# EAGLE design DIP8051-50x100-realaddr-partsmt (EAGLE 7.6.0)
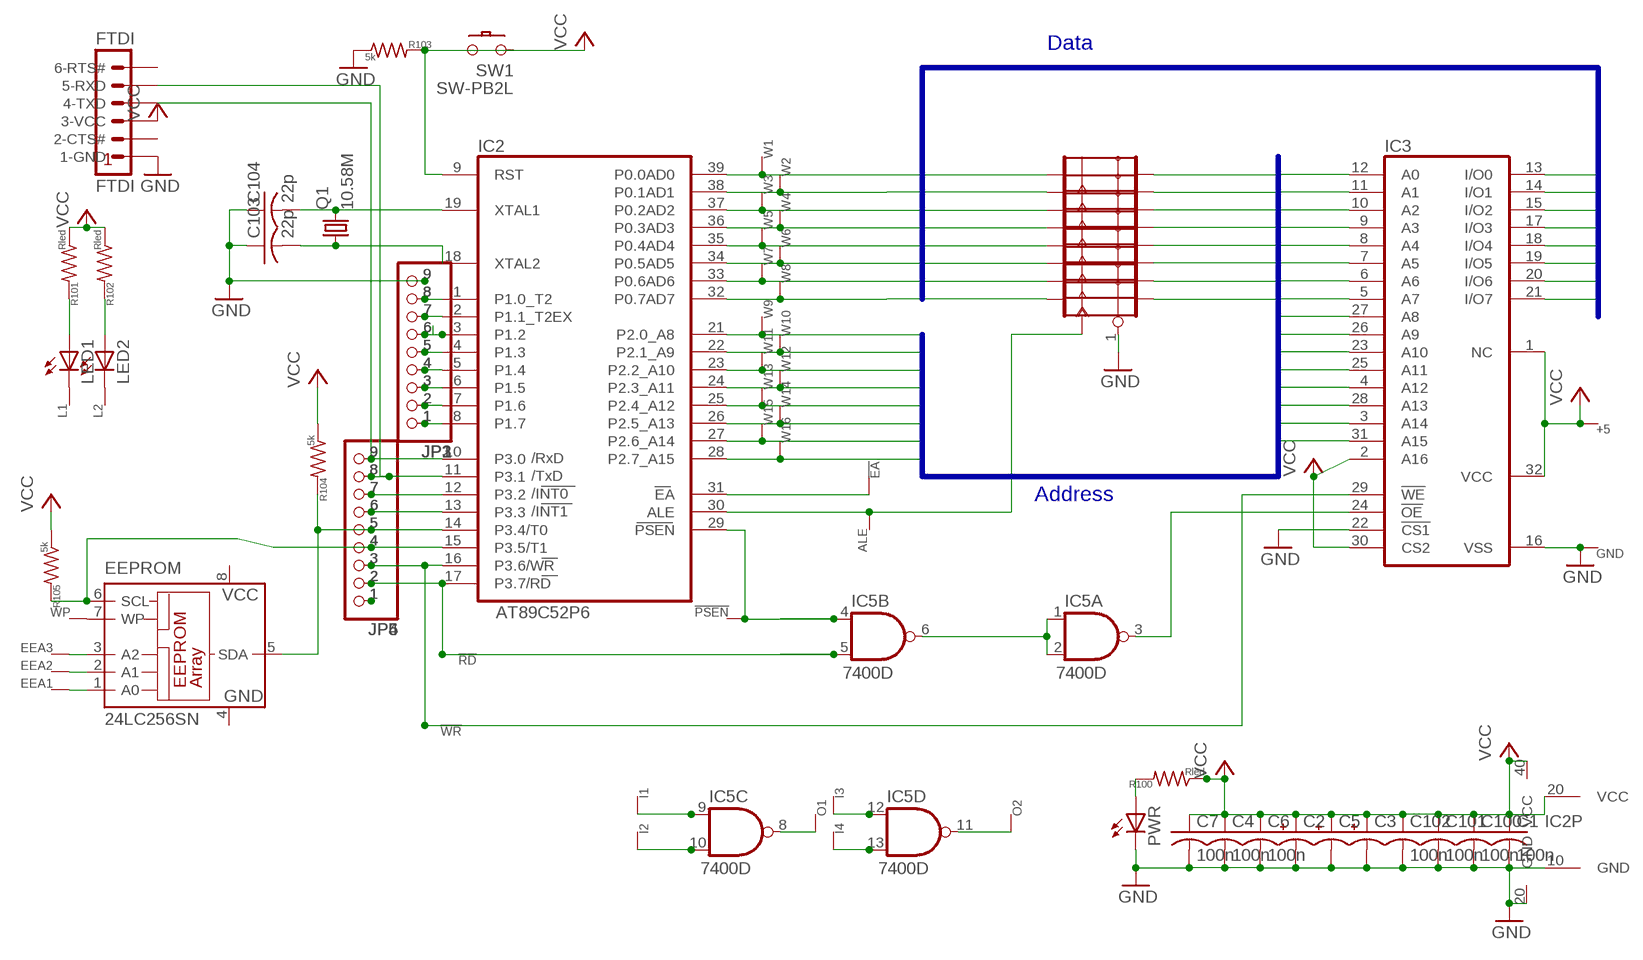
[diagram p0: schematic, sheet 1]

## Parts
!EA  WIRE-R10  [VIA10]
!PSEN  WIRE-R10  [VIA10]
!RD  WIRE-R10  [VIA10]
!WR  WIRE-R10  [VIA10]
+5  WIRE-R12  [VIA12]
ALE  WIRE-R10  [VIA10]
C1  100n  C-US-5MM  [C050-024X044]
C2  CPOL-US-C  [SMC_C]
C3  CPOL-USE2.5-7  [E2,5-7]
C4  100n  C-USC0805  [C0805]
C5  CPOL-US-C  [SMC_C]
C6  100n  C-US-5MM  [C050-024X044]
C7  100n  C-USC0805  [C0805]
C100  100n  C-USC0805  [C0805]
C101  100n  C-USC0805  [C0805]
C102  100n  C-USC0805  [C0805]
C103  22p  C-USC0805  [C0805]
C104  22p  C-USC0805  [C0805]
EEA1  WIRE-R6  [VIA6]
EEA2  WIRE-R6  [VIA6]
EEA3  WIRE-R6  [VIA6]
EEPROM  24LC256SN  [SO-08]
FTDI  FTDI  FTDI-TTL232R  [MA06-1]
GND  WIRE-R12  [VIA12]
I1  WIRE-VIA8  [VIA8]
I2  WIRE-VIA8  [VIA8]
I3  WIRE-VIA8  [VIA8]
I4  WIRE-VIA8  [VIA8]
IC1  74573D  [SO20W]
IC2  AT89C52P6  [DIL40]
IC3  MEM128K-PS  [DIL32]
IC5  7400D  [SO14]
JP1  PINHD-1X9  [1X09]
JP2  PINHD-1X9  [1X09]
JP3  PINHD-1X9  [1X09]
JP4  PINHD-1X9  [1X09]
JP5  PINHD-1X9  [1X09]
JP6  PINHD-1X9  [1X09]
L1  WIRE-VIA8  [VIA8]
L2  WIRE-VIA8  [VIA8]
LED1  LED3MM  [LED3MM]
LED2  LED3MM  [LED3MM]
O1  WIRE-VIA8  [VIA8]
O2  WIRE-VIA8  [VIA8]
PWR  LED3MM  [LED3MM]
Q1  10.58M  CRYSTALHC49S  [HC49/S]
R100  Rled  R-US_R0805  [R0805]
R101  Rled  R-US_R0805  [R0805]
R102  Rled  R-US_R0805  [R0805]
R103  5k  R-US_R0805  [R0805]
R104  5k  R-US_R0805  [R0805]
R105  5k  R-US_R0805  [R0805]
SW1  SW-PB2L  [SW-PB]
W1  WIRE-R10  [VIA10]
W2  WIRE-R10  [VIA10]
W3  WIRE-R10  [VIA10]
W4  WIRE-R10  [VIA10]
W5  WIRE-R10  [VIA10]
W6  WIRE-R10  [VIA10]
W7  WIRE-R10  [VIA10]
W8  WIRE-R10  [VIA10]
W9  WIRE-R10  [VIA10]
W10  WIRE-R10  [VIA10]
W11  WIRE-R10  [VIA10]
W12  WIRE-R10  [VIA10]
W13  WIRE-R10  [VIA10]
W14  WIRE-R10  [VIA10]
W15  WIRE-R10  [VIA10]
W16  WIRE-R10  [VIA10]
WP  WIRE-VIA8  [VIA8]

## Nets
!EA: !EA.P$1 IC2.31(EA)
!OE: IC3.24(!OE) IC5.3(A:O)
!RD: !RD.P$1 IC2.17(P3.7/RD) IC5.5(B:I1) JP4.2 JP5.2 JP6.2
!WR: !WR.P$1 IC2.16(P3.6/WR) IC3.29(!WE) JP4.3 JP5.3 JP6.3
A0: IC1.19(Q) IC3.12(A0)
A1: IC1.18(Q) IC3.11(A1)
A2: IC1.17(Q) IC3.10(A2)
A3: IC1.16(Q) IC3.9(A3)
A4: IC1.15(Q) IC3.8(A4)
A5: IC1.14(Q) IC3.7(A5)
A6: IC1.13(Q) IC3.6(A6)
A7: IC1.12(Q) IC3.5(A7)
A8: IC2.21(P2.0_A8) IC3.27(A8) W9.P$1
A9: IC2.22(P2.1_A9) IC3.26(A9) W10.P$1
A10: IC2.23(P2.2_A10) IC3.23(A10) W11.P$1
A11: IC2.24(P2.3_A11) IC3.25(A11) W12.P$1
A12: IC2.25(P2.4_A12) IC3.4(A12) W13.P$1
A13: IC2.26(P2.5_A13) IC3.28(A13) W14.P$1
A14: IC2.27(P2.6_A14) IC3.3(A14) W15.P$1
A15: IC2.28(P2.7_A15) IC3.31(A15) W16.P$1
ALE: ALE.P$1 IC1.11(CLK) IC2.30(ALE)
D0: IC1.2(D) IC2.39(P0.0AD0) IC3.13(I/O0) W1.P$1
D1: IC1.3(D) IC2.38(P0.1AD1) IC3.14(I/O1) W2.P$1
D2: IC1.4(D) IC2.37(P0.2AD2) IC3.15(I/O2) W3.P$1
D3: IC1.5(D) IC2.36(P0.3AD3) IC3.17(I/O3) W4.P$1
D4: IC1.6(D) IC2.35(P0.4AD4) IC3.18(I/O4) W5.P$1
D5: IC1.7(D) IC2.34(P0.5AD5) IC3.19(I/O5) W6.P$1
D6: IC1.8(D) IC2.33(P0.6AD6) IC3.20(I/O6) W7.P$1
D7: IC1.9(D) IC2.32(P0.7AD7) IC3.21(I/O7) W8.P$1
GND [power]: C1.2 C2.- C3.- C4.2 C5.- C6.2 C7.2 C100.2 C101.2 C102.2 C103.1 C104.1 FTDI.1(1-GND) GND.P$1 IC1.1(OE) IC1.10(GND) IC2.20(GND) IC3.16(VSS) IC3.22(!CS1) JP1.9 JP2.9 JP3.9 PWR.K(C) R103.1
N$1: IC2.8(P1.7) JP1.1 JP2.1 JP3.1
N$3: EEA3.P$1 EEPROM.3(A2)
N$5: LED1.A R101.2
N$6: PWR.A R100.2
N$7: LED2.A R102.2
N$8: EEA2.P$1 EEPROM.2(A1)
N$9: EEA1.P$1 EEPROM.1(A0)
N$10: IC5.1(A:I0) IC5.2(A:I1) IC5.6(B:O)
N$11: IC2.7(P1.6) JP1.2 JP2.2 JP3.2
N$12: EEPROM.7(WP) WP.P$1
N$13: IC2.6(P1.5) JP1.3 JP2.3 JP3.3
N$14: IC2.5(P1.4) JP1.4 JP2.4 JP3.4
N$15: IC2.4(P1.3) JP1.5 JP2.5 JP3.5
N$16: IC2.2(P1.1_T2EX) JP1.7 JP2.7 JP3.7
N$17: C103.2 IC2.18(XTAL2) Q1.1
N$18: C104.2 IC2.19(XTAL1) Q1.2
N$19: IC2.1(P1.0_T2) JP1.8 JP2.8 JP3.8
N$20: IC2.12(P3.2) JP4.7 JP5.7 JP6.7
N$21: IC2.13(P3.3) JP4.6 JP5.6 JP6.6
N$22: !PSEN.P$1 IC2.29(PSEN) IC5.4(B:I0)
N$23: I3.P$1 IC5.12(D:I0)
N$24: I4.P$1 IC5.13(D:I1)
N$25: IC5.11(D:O) O2.P$1
N$26: IC2.3(P1.2) JP1.6 JP2.6 JP3.6
N$27: I1.P$1 IC5.9(C:I0)
N$28: I2.P$1 IC5.10(C:I1)
N$29: IC5.8(C:O) O1.P$1
N$31: JP4.1 JP5.1 JP6.1
N$33: L1.P$1 LED1.K(C)
N$35: L2.P$1 LED2.K(C)
N$36: IC2.9(RST) R103.2 SW1.2
RXD: FTDI.4(4-TXD) IC2.10(P3.0) JP4.9 JP5.9 JP6.9
T0: EEPROM.5(SDA) IC2.14(P3.4/T0) JP4.5 JP5.5 JP6.5 R104.2
T1: EEPROM.6(SCL) IC2.15(P3.5/T1) JP4.4 JP5.4 JP6.4 R105.2
TXD: FTDI.5(5-RXD) IC2.11(P3.1) JP4.8 JP5.8 JP6.8
VCC [power]: +5.P$1 C1.1 C2.+ C3.+ C4.1 C5.+ C6.1 C7.1 C100.1 C101.1 C102.1 FTDI.3(3-VCC) IC1.20(VCC) IC2.40(VCC) IC3.1(NC) IC3.2(A16) IC3.30(CS2) IC3.32(VCC) R100.1 R101.1 R102.1 R104.1 R105.1 SW1.4
Unconnected: FTDI.2(2-CTS#) FTDI.6(6-RTS#)

## Buses
D[0..7]
A[0..15]

## Notes on the sheet
- Data
- Address

## Power pins joined to a net without a drawn wire
GND: EEPROM.4(GND) IC5.7(P:GND) SW1.5(GND)
VCC: EEPROM.8(VCC) IC5.14(P:VCC)

## Library data of the parts
!EA !PSEN !RD !WR +5 ALE EEA1-EEA3 GND I1-I4 L1 L2 O1 O2 W1-W16 WP = mylib4:WIRE: Pad for a wire offboard
C1 C4 C6 C7 C100-C104 = my-rcl:C-US: CAPACITOR, American symbol
C2 C3 C5 = my-rcl:CPOL-US: POLARIZED CAPACITOR, American symbol
EEPROM = microchip-6:24*: Serial EEPROM I2C
FTDI = mylib4:FTDI-TTL232R: FTDI USB to serial (TTL level) cable
IC1 = mylib4:74*573: 74x573 and similar octal latches, with gate-swappable latches
IC2 = atmel:AT89C*52: MICROCONTROLLER 8 Kbytes FLASH; 2K Bytes EEPROM Compatible with MCS-51 Products at89s8252.pdf; OC_FARNELL: unknown; OC_NEWARK: unknown
IC3 = mylib4:MEM128K-PS: MEMORY; OC_FARNELL: unknown; OC_NEWARK: unknown
IC5 = mylib4:74*00: Quad 2-input NAND gate
JP1-JP6 = pinhead:PINHD-1X9: PIN HEADER
LED1 LED2 PWR = my-led:LED: LED OSRAM: - CHIPLED LG R971, LG N971, LY N971, LG Q971, LY Q971, LO R971, LY R971 LH N974, LH R974 LS Q976, LO Q976, LY Q976 LO Q996 - Hyper CHIPLED LW Q18S LB Q993, LB Q99A, LB R99A - SideLED LS A670, LO A670, LY A670, LG A670, LP A670 LB A673, LV A673, LT A673, LW A673 LH A674 LY A675 LS A676, LA A676, LO A676, LY A676, LW A676 LS A679, LY A679, LG A679 - Hyper Micro SIDELED® LS Y876, LA Y876, LO Y876, LY Y876 LT Y87S - SmartLED LW L88C, LW L88S LB L89C, LB L89S, LG L890 LS L89K, LO L89K, LY L89K LS L896, LA L896, LO L896, LY L896 - TOPLED LS T670, LO T670, LY T670, LG T670, LP T670 LSG T670, LSP T670, LSY T670, LOP T670, LYG T670 LG T671, LOG T671, LSG T671 LB T673, LV T673, LT T673, LW T673 LH T674 LS T676, LA T676, LO T676, LY T676, LB T676, LH T676, LSB T676, LW T676 LB T67C, LV T67C, LT T67C, LS T67K, LO T67K, LY T67K, LW E67C LS E67B, LA E67B, LO E67B, LY E67B, LB E67C, LV E67C, LT E67C LW T67C LS T679, LY T679, LG T679 LS T770, LO T770, LY T770, LG T770, LP T770 LB T773, LV T773, LT T773, LW T773 LH T774 LS E675, LA E675, LY E675, LS T675 LS T776, LA T776, LO T776, LY T776, LB T776 LHGB T686 LT T68C, LB T68C - Hyper Mini TOPLED® LB M676 - Mini TOPLED Santana® LG M470 LS M47K, LO M47K, LY M47K Source: http://www.osram.convergy.de/
Q1 = mylib4:CRYSTAL: CRYSTAL
R100-R105 = my-rcl:R-US_: RESISTOR, American symbol
SW1 = mylib4:SW-PB2; PARTNO: test2

## Net classes
0 default: width 0.3 mm, drill 0.4 mm, clearance 0.3 mm
1 power: width 0.5 mm, drill 0.6 mm, clearance 0.4 mm

## Board
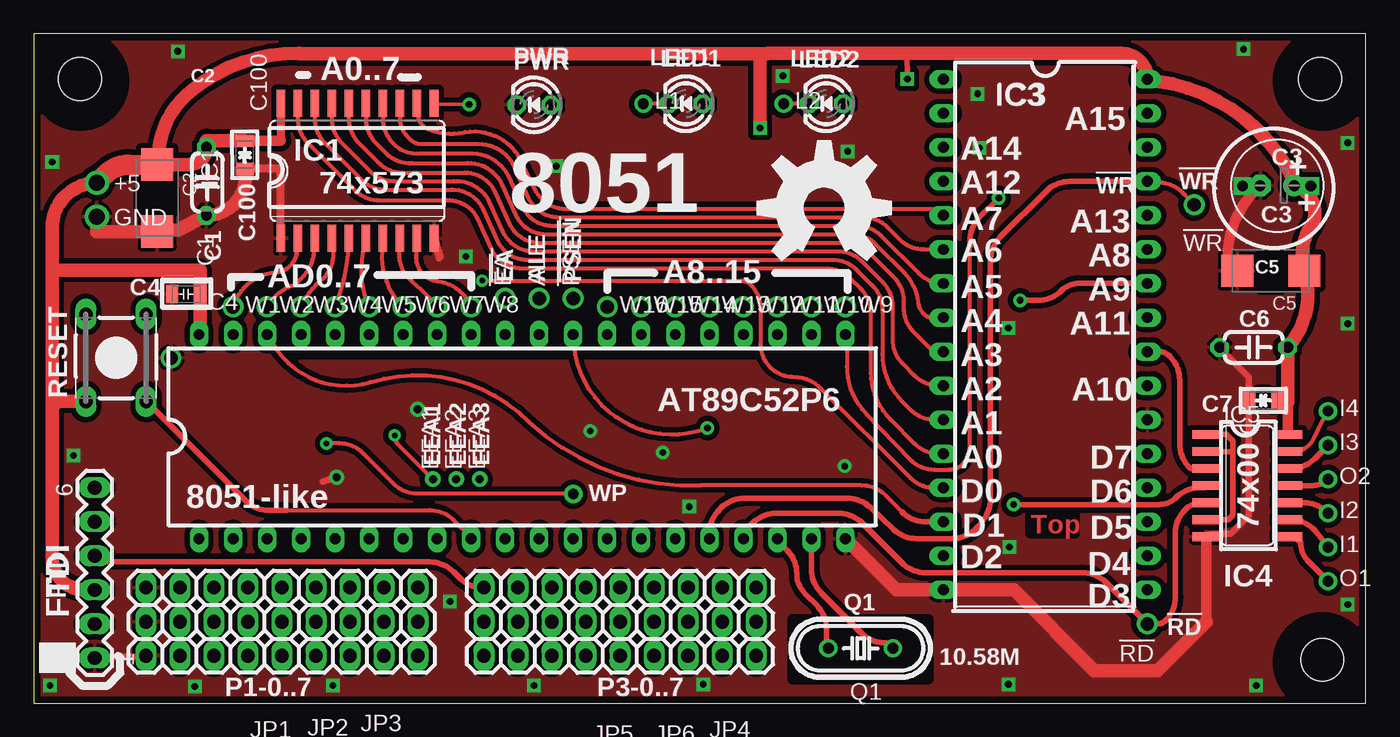
[diagram p1: board, top side]
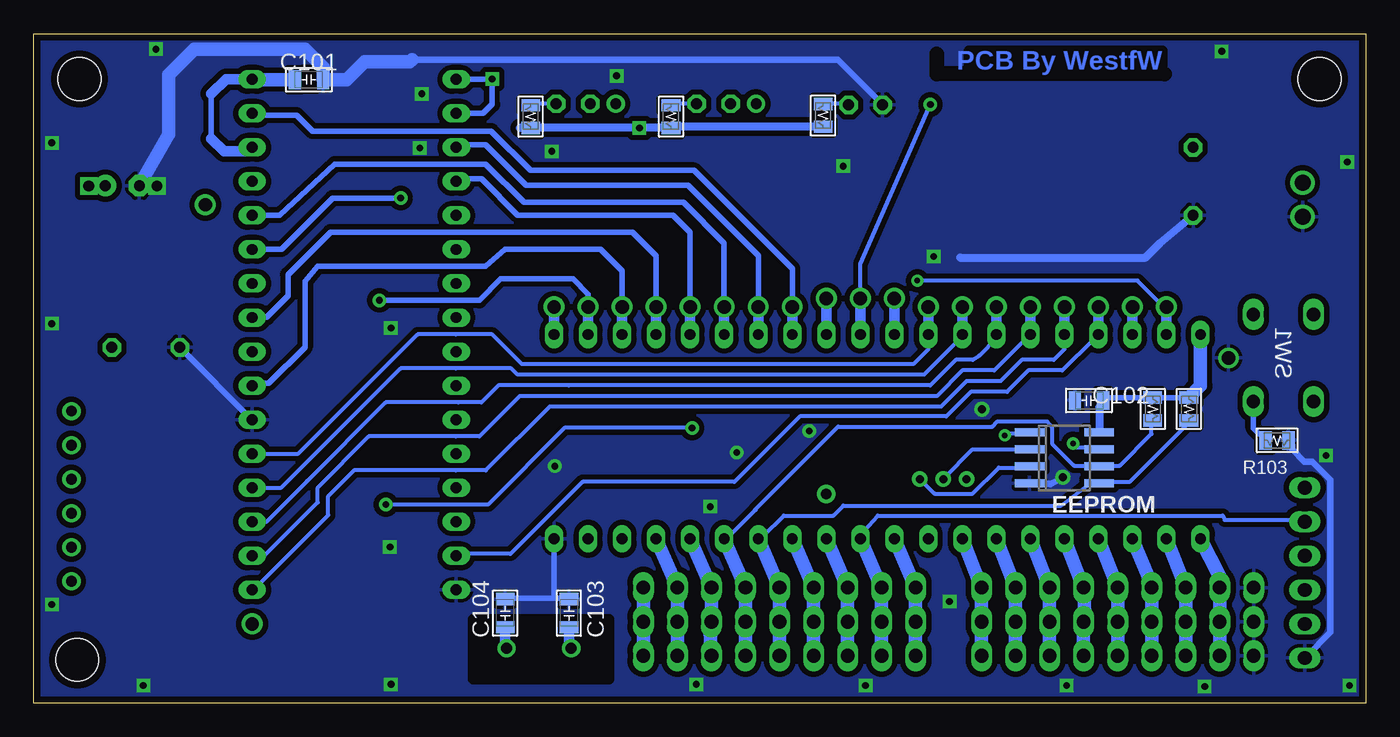
[diagram p2: board, bottom side, seen from below]

Size 99.48 x 49.97 mm. Coordinates in mm from the lower left corner, seen from the top.
Outline: 0,0 99.48,0 99.48,49.97 0,49.97 0,0
Copper layers (1*16): Top 0.035mm / dielectric 1.5mm / Bottom 0.035mm
Design rules "default *": minimum track width 7mil, minimum drill 0.3mm, track to track 8mil, track to pad 8mil, pad to pad 8mil, via to via 8mil, smd to smd 8mil, copper to edge 20mil, drill to drill 8mil, minimum pad ring 11mil, minimum via ring 10mil, stop-mask expansion 4mil, vias tented up to drill 0.65mm, thermal gap 10mil
Holes 3.2 mm at 3.46,46.58 96.04,46.58 96.2,3.22
tRestrict: area 7.9,36.7 to 10.6,38.3; area 91.6,30.8 to 93.2,33.5; area 11.1,29.9 to 11.9,31.3; area 91.4,21.9 to 92.2,23.4; area 15.1,40.4 to 16.2,41.2; area 56.7,1.8 to 66.8,6.2; area 93.2,43.4 to 99.2,49.4; area 93.2,0.1 to 99.2,6.1; area 0.5,43.4 to 6.5,49.4; 2 lines
bRestrict: area 13.5,50.8 to 14.9,51.7; area 78.4,45.8 to 79.3,47.3; area 56.5,1.8 to 66.7,6.2; 2 lines

### Footprints (pad centres in the part's own frame; a part is rotated, then mirrored left to right if it is on the bottom)
VIA10 = drill 1: P$1 0,0
VIA12 = drill 1.2: P$1 0,0
C050-024X044 = drill 0.813 octagon: 1 -2.54,0; 2 2.54,0
SMC_C = smd 2.4 x 2.4: + -2.5,0; - 2.5,0
E2,5-7 = drill 0.813 pad 1.6: + -1.27,0 | drill 0.813 pad 1.6 octagon: - 1.27,0
C0805 = smd 0.914 x 1.397: 1 -1.053,0; 2 1.053,0
VIA6 = drill 0.6: P$1 0,0
SO-08 = smd 0.6 x 2.2: 1 -1.905,-2.6; 2 -0.635,-2.6; 3 0.635,-2.6; 4 1.905,-2.6; 5 1.905,2.6; 6 0.635,2.6; 7 -0.635,2.6; 8 -1.905,2.6
MA06-1 = drill 1.016 long: 1 -6.35,0; 2 -3.81,0; 3 -1.27,0; 4 1.27,0; 5 3.81,0; 6 6.35,0
VIA8 = drill 0.8: P$1 0,0
SO20W = smd 0.66 x 2.032: 1 -5.08,-5.029; 2 -3.81,-5.029; 3 -2.54,-5.029; 4 -1.27,-5.029; 5 0,-5.029; 6 1.27,-5.029; 7 2.54,-5.029; 8 3.81,-5.029; 9 5.08,-5.029; 10 6.35,-5.029; 11 6.35,5.029; 12 5.08,5.029; 13 3.81,5.029; 14 2.54,5.029; 15 1.27,5.029; 16 0,5.029; 17 -1.27,5.029; 18 -2.54,5.029; 19 -3.81,5.029; 20 -5.08,5.029
DIL40 = drill 0.813 long: 1 -24.13,-7.62; 2 -21.59,-7.62; 3 -19.05,-7.62; 4 -16.51,-7.62; 5 -13.97,-7.62; 6 -11.43,-7.62; 7 -8.89,-7.62; 8 -6.35,-7.62; 9 -3.81,-7.62; 10 -1.27,-7.62; 11 1.27,-7.62; 12 3.81,-7.62; 13 6.35,-7.62; 14 8.89,-7.62; 15 11.43,-7.62; 16 13.97,-7.62; 17 16.51,-7.62; 18 19.05,-7.62; 19 21.59,-7.62; 20 24.13,-7.62; 21 24.13,7.62; 22 21.59,7.62; 23 19.05,7.62; 24 16.51,7.62; 25 13.97,7.62; 26 11.43,7.62; 27 8.89,7.62; 28 6.35,7.62; 29 3.81,7.62; 30 1.27,7.62; 31 -1.27,7.62; 32 -3.81,7.62; 33 -6.35,7.62; 34 -8.89,7.62; 35 -11.43,7.62; 36 -13.97,7.62; 37 -16.51,7.62; 38 -19.05,7.62; 39 -21.59,7.62; 40 -24.13,7.62
DIL32 = drill 0.813 long: 1 -19.05,-7.62; 2 -16.51,-7.62; 3 -13.97,-7.62; 4 -11.43,-7.62; 5 -8.89,-7.62; 6 -6.35,-7.62; 7 -3.81,-7.62; 8 -1.27,-7.62; 9 1.27,-7.62; 10 3.81,-7.62; 11 6.35,-7.62; 12 8.89,-7.62; 13 11.43,-7.62; 14 13.97,-7.62; 15 16.51,-7.62; 16 19.05,-7.62; 17 19.05,7.62; 18 16.51,7.62; 19 13.97,7.62; 20 11.43,7.62; 21 8.89,7.62; 22 6.35,7.62; 23 3.81,7.62; 24 1.27,7.62; 25 -1.27,7.62; 26 -3.81,7.62; 27 -6.35,7.62; 28 -8.89,7.62; 29 -11.43,7.62; 30 -13.97,7.62; 31 -16.51,7.62; 32 -19.05,7.62
SO14 = smd 0.66 x 2.032: 1 -3.81,-3.073; 2 -2.54,-3.073; 3 -1.27,-3.073; 4 0,-3.073; 5 1.27,-3.073; 6 2.54,-3.073; 7 3.81,-3.073; 8 3.81,3.073; 9 2.54,3.073; 10 1.27,3.073; 11 0,3.073; 12 -1.27,3.073; 13 -2.54,3.073; 14 -3.81,3.073
1X09 = drill 1.016 long: 1 -10.16,0; 2 -7.62,0; 3 -5.08,0; 4 -2.54,0; 5 0,0; 6 2.54,0; 7 5.08,0; 8 7.62,0; 9 10.16,0
LED3MM = drill 0.813 octagon: A -1.27,0; K 1.27,0
HC49/S = drill 0.813: 1 -2.413,0; 2 2.413,0
R0805 = smd 0.914 x 1.397: 1 -0.85,0; 2 0.85,0
SW-PB = drill 1 long: 1 3.25,-2.25; 2 -3.25,-2.25; 3 3.25,2.25; 4 -3.25,2.25 | drill 1: 5 0,-4.1

### Placement (x,y rotation side)
!EA  35.21,30.2 90 top
!PSEN  40.29,30.2 90 top
!RD  83.16,5.91 0 top
!WR  86.65,37.19 0 top
+5  4.74,38.82 0 top
ALE  37.75,30.2 90 top
C1  12.91,38.93 270 top
C2  9.24,37.69 270 top
C3  92.84,38.61 180 top
C4  11.4,30.52 180 top
C5  92.36,32.26 180 top
C6  91.09,26.55 180 top
C7  91.81,22.58 180 top
C100  15.77,40.92 270 top
C101  78.92,46.52 0 bottom
C102  20.69,22.58 180 bottom
C103  59.5,6.71 270 bottom
C104  64.26,6.71 270 bottom
EEA1  29.81,16.71 90 top
EEA2  31.56,16.71 90 top
EEA3  33.31,16.71 90 top
EEPROM  22.51,18.3 270 bottom
FTDI  4.57,9.72 90 top
GND  4.74,36.28 0 top
I1  96.65,11.63 0 top
I2  96.65,14.17 0 top
I3  96.65,19.25 0 top
I4  96.65,21.79 0 top
IC1  23.54,39.73 0 top
IC2  36.48,19.88 0 top
IC3  75.53,27.5 270 top
IC5  90.62,16.23 270 top
JP1  18.54,8.61 180 top
JP2  18.54,6.07 180 top
JP3  18.54,3.53 180 top
JP4  43.78,8.61 180 top
JP5  43.78,6.07 180 top
JP6  43.78,3.53 180 top
L1  45.53,44.73 0 top
L2  56.01,44.73 0 top
LED1  48.71,44.73 180 top
LED2  59.18,44.73 180 top
O1  96.65,9.09 0 top
O2  96.65,16.71 0 top
PWR  37.36,44.65 180 top
Q1  61.75,4.09 0 top
R100  40.53,43.85 90 bottom
R101  51.88,43.77 90 bottom
R102  62.36,43.77 90 bottom
R103  6.64,19.6 180 bottom
R104  13.23,21.95 270 bottom
R105  15.92,21.95 270 bottom
SW1  6.16,25.76 90 top
W1  14.89,29.57 0 top
W2  17.43,29.57 0 top
W3  19.97,29.57 0 top
W4  22.51,29.57 0 top
W5  25.05,29.57 0 top
W6  27.59,29.57 0 top
W7  30.13,29.57 0 top
W8  32.67,29.57 0 top
W9  60.61,29.57 0 top
W10  58.07,29.57 0 top
W11  55.53,29.57 0 top
W12  52.99,29.57 0 top
W13  50.45,29.57 0 top
W14  47.91,29.57 0 top
W15  45.37,29.57 0 top
W16  42.83,29.57 0 top
WP  40.29,15.6 0 top

### Tracks (layer width: path | path; a pad name or v marks a point on that pad's centre or on a via)
!EA
  Bottom 0.8: IC2.31 !EA.P$1
!OE
  Top 0.4: IC5.3 86.48,17.5 arc-45 86.3,17.58 arc-45 85.56,19.35 85.56,24.1 arc45 84.83,25.87 arc45 83.92,26.25 83.17,26.25 IC3.24
!RD
  Top 0.4: IC2.17 52.99,12.74 53.71,13.45 arc-45 55.47,14.18 60.07,14.18 arc-45 61.84,13.45 64.82,10.47 arc45 66.59,9.74 78.3,9.74 arc-45 80.06,9 !RD.P$1 83.95,5.91 arc45 84.51,6.14 arc45 85.25,7.91 85.25,12.67 arc-45 85.98,14.44 arc-45 87.28,14.98 IC5.5
  Bottom 1: JP6.2 JP5.2 JP4.2 IC2.17
!WR
  Top 0.3: !WR.P$1 86.52,37.23 85.91,37.96 arc48 84.07,38.85 83.22,38.88 IC3.29
  Top 0.4: IC3.29 77.37,38.93 arc45 75.6,38.2 72.16,34.76 arc45 71.43,33 71.43,15.19 arc-38 70.91,13.67 70.59,13.25 arc-52 68.61,12.28 65.92,12.28 arc-44 64.2,12.96 62.47,14.61 arc44 60.74,15.29 53.09,15.29 arc45 51.32,14.56 51.2,14.44 arc45 50.47,12.67 50.47,12.28 IC2.16
  Bottom 1: JP6.3 49.04,6.56 JP5.3 JP4.3 IC2.16
A0
  Top 0.3: IC1.19 19.73,43.57 arc45 20.47,41.8 23.85,38.42 arc45 25.62,37.53 30.83,37.53 arc-66 33.11,36.22 34.16,33.91 arc66 36.44,32.44 59.2,32.44 arc-45 60.97,31.71 61.77,30.91 arc-45 62.5,29.15 62.5,24.71 arc45 63.96,21.17 65.78,19.36 arc45 67.54,18.63 67.9,18.63 IC3.12
A1
  Top 0.3: IC1.18 21,43.57 arc45 21.74,41.8 24.49,39.05 arc45 26.25,38.32 31.27,38.32 arc-66 33.55,36.85 34.6,34.54 arc66 36.87,33.08 59.68,33.08 arc-45 61.44,32.35 62.64,31.15 arc-45 63.37,29.38 63.37,26.06 arc45 64.84,22.52 65.46,21.9 arc45 67.22,21.17 67.9,21.17 IC3.11
A2
  Top 0.3: IC1.17 22.27,43.57 arc45 23.01,41.8 25.12,39.69 arc45 26.89,38.95 31.39,38.95 arc-66 33.98,37.49 35.03,35.18 arc66 37.31,33.71 60.06,33.71 arc-45 61.84,32.97 63.41,31.39 arc-45 64.13,29.63 64.13,27.13 arc45 64.86,25.36 65.78,24.44 arc45 67.54,23.71 67.9,23.71 IC3.10
A3
  Top 0.3: IC1.16 23.54,43.57 arc45 24.28,41.8 25.76,40.32 arc45 27.52,39.59 32.19,39.59 arc-66 34.46,38.12 35.51,35.82 arc66 37.79,34.35 60.63,34.35 arc-45 62.4,33.62 64.23,31.79 arc-45 64.96,30.02 64.96,29.47 arc45 65.69,27.7 67.14,26.25 67.9,26.25 IC3.9
A4
  Top 0.3: IC1.15 24.81,43.57 arc45 25.55,41.8 26.39,40.96 arc45 28.24,40.3 32.42,40.3 arc-66 34.94,38.76 35.99,36.45 arc66 38.26,34.98 59.52,34.98 61.1,34.98 arc-45 62.87,34.25 64.94,32.18 arc-39 66.03,29.9 arc106 IC3.8
A5
  Top 0.3: 67.89,31.33 IC3.7 67.89,31.33 | 67.89,31.33 67.86,31.33 arc-45 66.09,32.06 63.27,34.89 arc45 61.5,35.62 60,35.62 38.74,35.62 arc-66 36.46,37.09 35.41,39.39 arc66 32.5,41.02 28.8,41.02 arc-45 27.03,41.59 26.82,41.8 arc-45 26.08,43.57 IC1.14
A6
  Top 0.3: 67.86,33.79 IC3.6 67.62,33.87 66.43,33.87 arc-45 64.66,34.61 63.75,35.52 arc45 61.98,36.26 60.31,36.26 39.22,36.26 arc-66 36.94,37.72 35.89,40.03 arc66 33.22,41.73 28.75,41.73 arc-45 27.93,42.28 arc-45 27.36,43.57 IC1.13
A7
  Top 0.3: 67.7,36.18 IC3.5 67.42,36.89 60.95,36.89 39.69,36.89 arc-65 37.41,38.35 36.52,40.19 arc78 32.21,42.61 arc-34 29.43,42.85 arc-53 28.71,43.72 IC1.12
A8  (via drill 0.5)
  Top 0.3: 69.9,34.1 69.9,19.54 arc-45 69.32,17.77 arc-45 68.33,17.43 67.23,17.43 arc-45 65.47,18.16 62.12,21.64 arc-44 60.72,25.11 60.72,27.48 IC2.21
  Top 0.4: 69.9,34.1 69.9,34.48 arc-45 70.63,36.25 v72.07,37.68
  Bottom 0.4: v72.07,37.68 77.15,37.68 80.96,33.87 83.14,33.87 IC3.27
  Bottom 0.8: IC2.21 W9.P$1
A9  (via drill 0.5)
  Top 0.4: v73.65,30.06 75,30.06 arc45 76.77,30.79 arc-45 78.07,31.33 83.14,31.33 IC3.26
  Bottom 0.4: W10.P$1 58.07,30.52 59.2,31.65 64.6,31.65 66.19,30.06 v73.65,30.06
  Bottom 0.8: IC2.22 W10.P$1
A10
  Bottom 0.4: IC2.23 55.53,32.27 57.14,33.87 64.28,33.87 65.71,32.6 78.26,32.6 79.21,31.49 79.21,26.57 81.91,23.87 82.98,23.87 IC3.23
  Bottom 0.8: IC2.23 W11.P$1
A11
  Bottom 0.4: W12.P$1 52.99,33.38 54.76,35.14 77.31,35.14 80.48,31.97 80.48,30.38 82.07,28.79 83.14,28.79 IC3.25
  Bottom 0.8: IC2.24 W12.P$1
A12
  Bottom 0.4: W13.P$1 50.45,35.13 51.74,36.41 63.33,36.41 66.03,39.11 67.73,39.11 IC3.4
  Bottom 0.8: IC2.25 W13.P$1
A13
  Bottom 0.4: W14.P$1 47.91,34.33 50.95,37.37 62.85,37.37 65.71,40.23 76.99,40.23 81.12,36.41 83.13,36.41 IC3.28
  Bottom 0.8: IC2.26 W14.P$1
A14
  Bottom 0.4: W15.P$1 45.37,33.38 50.63,38.64 62.7,38.64 65.71,41.65 67.73,41.65 IC3.3
  Bottom 0.8: IC2.27 W15.P$1
A15
  Bottom 0.4: W16.P$1 42.83,32.43 50.15,39.75 62.38,39.75 65.32,42.69 78.66,42.69 79.85,43.88 83.02,43.88 IC3.31
  Bottom 0.8: W16.P$1 IC2.28
ALE  (via drill 0.5)
  Top 0.3: v32.52,44.67 29.98,44.67 IC1.11
  Bottom 0.3: ALE.P$1 37.75,32.77 v32.52,44.67
  Bottom 0.8: IC2.30 ALE.P$1
D0  (via drill 0.4)
  Top 0.3: v33.5,31.53 52.81,31.53 arc-45 53.54,31.23 arc-45 54.27,29.46 54.27,26.78 arc45 54.98,25.08 arc45 56.74,24.35 arc-45 58.75,23.51 65.46,16.81 arc45 67.22,16.08 67.77,16.08 IC3.13 | IC1.2 19.66,33.71 arc-81 18.07,32.13 arc69 W1.P$1
  Bottom 0.3: v33.5,31.53 17.07,31.53 15.27,29.73 W1.P$1
  Bottom 0.8: W1.P$1 IC2.39
D1
  Top 0.3: 64.84,14.26 63.59,15.51 arc45 61.82,16.25 49.83,16.25 arc-45 36.97,21.01 arc62 25.14,23.95 arc-75 17.91,26.73 IC2.38 arc27 IC2.38 | IC1.3 20.93,33.71 arc-62 19.03,31.01 arc37 W2.P$1
  Top 0.4: IC3.14 66.6,13.53 arc-45 64.84,14.26
  Bottom 0.8: IC2.38 W2.P$1
D2
  Top 0.3: IC1.4 22.36,33.71 arc-56 21.41,31.49 arc29 W3.P$1
  Bottom 0.3: IC3.15 67.77,11.13 63.87,11.13 58.49,16.51 47.15,16.51 42.26,21.4 31.33,21.4 29.5,23.23 26.81,23.23 25.22,24.82 22.68,24.82 20.37,27.13 19.97,27.48 IC2.37
  Bottom 0.8: W3.P$1 IC2.37
D3
  Top 0.3: IC1.5 23.47,33.71 arc-18 W4.P$1
  Bottom 0.3: IC3.17 83.03,8.45 77.47,14.02 77.47,15.45 75.56,17.36 67.94,17.36 65.71,17.36 60.95,22.12 59.52,22.12 31.73,22.12 29.82,24.03 27.28,24.03 25.7,25.62 23.31,25.62 22.51,26.42 IC2.36
  Bottom 0.8: IC2.36 W4.P$1
D4
  Top 0.3: IC1.6 24.58,33.56 arc36 W5.P$1
  Bottom 0.3: IC3.18 82.24,10.99 78.26,14.98 78.26,16.09 74.45,19.9 67.94,19.9 66.19,19.9 63.17,22.92 59.52,22.92 32.05,22.92 30.14,24.82 27.76,24.82 26.81,25.77 | IC2.35 25.08,27.5 26.81,25.77 | 26.81,25.77
  Bottom 0.8: IC2.35 W5.P$1
D5
  Top 0.3: IC1.7 26.01,33.71 arc50 W6.P$1
  Bottom 0.3: IC2.34 27.59,27.37 27.59,27.21 28.87,25.93 29.35,25.62 30.62,25.62 32.52,23.71 59.52,23.71 64.76,23.71 66.03,22.44 67.78,22.44 | 67.78,22.44 73.18,22.44 79.05,16.56 82.08,13.53 IC3.19 | 67.78,22.44
  Bottom 0.8: IC2.34 W6.P$1
D6
  Top 0.3: IC1.8 27.28,33.71 arc55 28.24,31.49 arc-12 W7.P$1
  Bottom 0.3: IC2.33 30.13,27.37 | IC3.20 80.97,16.07 72.07,24.98 67.94,24.98 63.81,24.98 63.33,24.5 59.52,24.5 33,24.5 30.13,27.37 | 30.13,27.37
  Bottom 0.8: IC2.33 W7.P$1
D7
  Top 0.3: IC1.9 28.55,33.4 arc86 30.14,31.49 arc-60 W8.P$1
  Bottom 0.3: IC2.32 32.67,26.42 33.8,25.3 59.52,25.3 63.01,25.3 65.24,27.52 67.94,27.52 70.8,27.52 79.7,18.61 IC3.21
  Bottom 0.8: IC2.32 W8.P$1
GND  (via drill 0.5, 0.6, 0.8)
  Top 0.5: C6.2 88.62,26.43 90.72,24.33 90.72,22.68 C7.2 90.72,22.38 90.72,13.98 89.37,12.63 87.87,12.63 IC5.7 | 35.97,44.73 PWR.K | FTDI.1 4.62,3.48 8.37,3.48 JP3.9 | JP3.9 8.37,3.63 JP3.9 | JP3.9 8.37,3.78 8.37,6.03 JP2.9 8.37,6.33 8.37,8.58 JP1.9 | 10.32,25.83 SW1.5 10.47,25.68 | 21.57,16.53 v22.63,16.84
  Top 0.6: IC1.10 30.3,33.24 | IC1.1 18.46,39.86 C100.2
  Top 0.8: IC5.7 87.54,6.08 | C5.- 89.12,32.26 89.12,33.12 arc-48 C3.-
  Top 1: GND.P$1 4.74,35.19 C2.- 9.71,35.28 10.77,35.28 | 10.77,35.28 C1.2 arc101 C100.2 | 9.55,35.28 10.77,35.28 | 87.54,6.08 83.89,2.43 79.21,2.43 73.19,8.45 IC3.16 64.42,8.45 IC2.20
  Bottom 0.4: 60.61,7.83 64.28,7.83 60.61,7.83 | 60.61,7.83 59.57,7.83 C103.1 | 60.61,7.83 IC2.20
  Bottom 0.5: IC3.22 83.22,21.18 88.47,26.43 C6.2 | 21.87,22.98 C102.2 | v22.63,16.84 23.55,16.33 arc-90 23.59,16.37 25.02,16.37 EEPROM.4 | FTDI.1 4.47,3.48 2.67,5.28 2.67,16.68 4.02,18.03 4.62,18.03 5.52,18.93 5.52,19.23 R103.1 | 71.22,48.03 39.42,48.03 36.12,44.73 PWR.K
  Bottom 0.6: 30.3,33.24 16.46,33.24 15.36,34.34 C1.2
  Bottom 1: 71.22,48.03 71.4,47.85 74.77,47.85 76.09,46.52 C101.2 77.86,47.45 79.21,48.8 87.47,48.8 89.38,46.89 89.38,42.45 C3.-
  other vias: 10.77,48.64 1.4,40.38 1.24,1.32 91.28,1.32 98.11,7.35 98.11,28.31 98.11,41.81 90.33,48.8 39.03,40.07 60.79,41.18 72.86,11.64 28.66,21.93 31.09,7.59 72.78,28 70.64,41.42 70.48,45.47 2.99,18.47 32.29,33.32 60.55,17.68 48.96,14.66 41.58,20.3 55.95,46.82 46.98,18.71 49.99,1.4 37.37,1.32 22.36,1.32 12.04,1.24 72.78,1.4 90.27,38.58
  pour Bottom (isolate 0.4): -0.67,50.71 99.86,50.71 99.86,-1.38 -1.46,-1.38 -1.46,48.01
  pour Top (isolate 0.4): -0.67,51.02 103.51,51.02 103.51,-2.02 -1.14,-2.02 -1.14,51.02
N$1
  Bottom 1: JP3.1 JP2.1 JP1.1 IC2.8
N$3
  Bottom 0.3: EEPROM.3 25.17,17.58 27.42,17.58 29.37,15.63 32.22,15.63 33.27,16.68 EEA3.P$1
N$5
  Bottom 0.3: R101.2 51.87,44.73 50.07,44.73 LED1.A
N$6
  Bottom 0.3: R100.2 40.47,44.73 38.67,44.73 PWR.A
N$7
  Bottom 0.3: R102.2 62.22,44.73 60.57,44.73 LED2.A
N$8
  Bottom 0.3: EEPROM.2 25.17,18.93 29.37,18.93 31.47,16.83 EEA2.P$1
N$9  (via drill 0.4)
  Top 0.3: v26.97,19.98 arc45 27.29,19.21 29.67,16.83 EEA1.P$1
  Bottom 0.3: v26.97,19.98 26.82,20.13 25.17,20.13 EEPROM.1
N$10
  Top 0.4: IC5.6 89.2,13.69 89.53,14.02 89.53,18.79 | 89.53,18.79 89.53,19.58 89.06,20.06 87.56,20.06 IC5.1 | IC5.2 89.52,18.77 89.53,18.79
N$11
  Bottom 1: IC2.7 JP1.2 JP2.2 JP3.2
N$12  (via drill 0.4)
  Top 0.3: v21.87,19.38 22.84,19.38 arc-45 24.61,18.64 26.89,16.36 arc45 28.66,15.63 40.17,15.63 WP.P$1
  Bottom 0.3: v21.87,19.38 21.57,19.08 19.92,19.08 EEPROM.7
N$13
  Bottom 1: JP3.3 JP2.3 JP1.3 IC2.6
N$14
  Bottom 1: IC2.5 JP1.4 20.93,5.45 JP2.4 JP3.4
N$15
  Bottom 1: JP3.5 JP2.5 JP1.5 IC2.4
N$16
  Bottom 1: IC2.2 JP1.7 JP2.7 JP3.7
N$17
  Top 0.4: IC2.18 55.53,12.14 56.25,11.42 arc-45 56.98,9.65 arc45 57.59,8.17 58.47,7.29 arc-45 59.2,5.52 59.2,4.22 Q1.1
  Bottom 0.8: Q1.1 59.5,4.09 C103.2
N$18
  Top 0.4: IC2.19 58.07,10 arc45 58.8,8.23 59.36,7.67 61.8,5.23 arc45 63.57,4.5 arc-45 63.89,4.37 Q1.2 64.26,4.19
  Bottom 0.8: Q1.2 64.26,4.09 C104.2
N$19
  Bottom 1: IC2.1 10.93,9.42 JP1.8 JP2.8 JP3.8
N$20
  Bottom 1: JP6.7 JP5.7 JP4.7 IC2.12
N$21
  Bottom 1: JP6.6 JP5.6 JP4.6 IC2.13
N$22  (via drill 0.5)
  Top 0.3: IC2.29 40.3,28.16 arc116 v50.31,20.53
  Top 0.4: v73.18,14.82 82.55,14.82 | 82.55,14.82 | 82.55,14.82 | 82.55,14.82 84.01,14.82 arc45 85.31,15.36 arc-45 87.08,16.09 87.4,16.09 IC5.4
  Bottom 0.3: v73.18,14.82 66.35,14.82 65.55,14.82 59.84,20.53 v50.31,20.53
  Bottom 0.4: v73.18,14.82
  Bottom 0.8: IC2.29 !PSEN.P$1
N$23
  Top 0.4: IC5.12 93.87,17.5 arc45 95.64,18.24 I3.P$1
N$24
  Top 0.3: IC5.13 94.14,18.79 arc64 95.57,19.74 arc-7 I4.P$1
N$25
  Top 0.4: IC5.11 95.5,16.23 arc45 O2.P$1
N$26
  Bottom 1: IC2.3 16.17,9.26 JP1.6 JP2.6 JP3.6
N$27
  Top 0.4: IC5.9 93.83,13.69 arc-52 95.81,12.72 I1.P$1
N$28
  Top 0.4: 96.49,14.33 I2.P$1 96.59,14.23 arc45 94.82,14.96 IC5.10
N$29
  Top 0.4: IC5.8 94.15,12.42 94.61,11.96 arc45 95.21,10.53 O1.P$1
N$31
  Bottom 1: JP6.1 JP5.1 JP4.1
N$33
  Top 0.3: L1.P$1 45.57,44.73 47.37,44.73 LED1.K
N$35
  Top 0.3: L2.P$1 56.07,44.73 57.87,44.73 LED2.K
N$36
  Top 0.3: 18.9,14.39 29.61,14.39 arc-45 31.37,13.66 32.7,12.33 32.67,12.33 IC2.9
  Top 0.4: 18.9,14.39 17.56,14.39 arc-45 15.79,15.12 SW1.2
  Bottom 0.4: R103.2 8.41,20.52 SW1.2
RXD
  Top 0.4: JP4.9 33.57,8.61 arc-45 31.8,9.34 31.35,9.8 arc45 29.58,10.53 5.04,10.53 FTDI.4
  Bottom 1: IC2.10 JP4.9 JP5.9 JP6.9
T0
  Bottom 0.3: R104.2 13.32,21.03 13.12,21.03 17.62,16.53 19.77,16.53 EEPROM.5 20.65,16.38 22.76,14.74 39.01,14.74 39.77,13.99 43.46,13.99 44.97,12.48 IC2.14
  Bottom 1: JP6.5 JP5.5 JP4.5 IC2.14
T1
  Bottom 0.3: R105.2 16.02,21.03 16.02,20.09 18.38,17.73 19.77,17.73 EEPROM.6 19.92,17.73 21.81,17.73 23.44,19.36 23.44,20.57 23.82,21.03 27.51,21.03 27.9,20.64 39.42,20.64 45.63,14.43 45.57,14.43 47.52,12.48 IC2.15
  Bottom 1: IC2.15 JP4.4 JP5.4 JP6.4
TXD
  Bottom 0.3: FTDI.5 4.62,13.68 10.56,13.68 10.71,13.99 36.45,13.99 37.8,12.48 IC2.11
  Bottom 1: JP6.8 JP5.8 JP4.8 IC2.11
VCC  (via drill 0.5, 0.8)
  Top 0.4: v65.24,46.58 65.22,48.48
  Top 0.6: IC1.20 18.46,41.97 | 93.63,20.1 93.69,20.1 IC5.14
  Top 0.8: 93.63,22.44 93.63,20.1 | C7.1 93.49,22.58 | 18.46,41.97 C100.1 | v95.35,38.58 94.14,38.58 C3.+
  Top 1: 93.49,22.58 93.63,22.44 C6.1 arc59 C5.+ arc-51 95.36,35.53 arc108 C3.+ arc-42 94.17,38.86 arc57 83.82,46.42 83.29,46.42 arc-90 IC3.32 arc90 81.22,48.48 79.53,48.48 65.22,48.48 54.85,48.48 arc45 54.76,48.44 | v54.24,42.92 54.24,48.44 54.76,48.44 | C100.1 12.91,41.97 C1.1 arc-90 11.63,40.19 C2.+ | FTDI.3 3.79,8.45 arc-90 1.4,10.85 1.4,22.12 | 1.4,22.12 1.4,25.3 1.4,32.29 | 1.4,32.29 1.4,35.48 arc-90 +5.P$1 | C2.+ 9.31,40.74 | C2.+ 9.34,41.18 arc-47 11.88,45.78 arc-39 19.82,48.48 arc-45 19.86,48.44 54.76,48.44 | IC2.40 12.45,27.6 C4.1 12.43,32.29 1.4,32.29 | SW1.4 1.78,22.51 1.4,22.12
  Top 1.5: +5.P$1 5.37,39.46 arc-45 7.14,40.19 C2.+
  Bottom 0.4: IC3.2 65.9,44.01 65.24,44.67 65.24,46.55 | 65.24,46.55 v65.24,46.58 65.24,46.55 | IC3.1 65.24,46.55 | 86.2,45.47 86.2,42.13 | 83.45,41.18 IC3.30 | C102.1 19.77,22.8 R105.1 R104.1
  Bottom 0.6: R100.1 51.8,43 R101.1 v54.24,42.92 R102.1 | R102.1 63.17,42.92 R102.1 | C102.1 19.91,22.06 EEPROM.8
  Bottom 0.8: IC3.32 85.11,46.55 86.2,45.47 | 86.2,42.13 85.25,41.18 83.45,41.18
  Bottom 1: C101.1 83.16,46.52 IC3.32 | R104.1 12.35,23.67 IC2.40

### Text on the board
Top: Top
Bottom: PCB By WestfW
Document: 8051 SBC with 64k RAM
EditHistory: 20170216, BillW, Sent to Fab at SEEEDStudio
EditHistory: 20170317 WestfW: Correct (shrink) some via sizes | 20170311 WestfW: More realistic package for C3 | 20170124 WestfW: Add tie points for c51 pins 21..40 | 20160920 WestfW: redo with address/datalines in "correct" spots. Add power connections. | 20130920 WestfW: Fix/approve some ERC errors; connect RAM A16 to +5V. | 20130919 WestfW: Initial revision finished.
_tSilk: PWR | LED1 | LED2 | A0..7 | C2 | IC3 | A15 | IC1 | A14 | + | C100 | 74x573 | A12 | !WR | !WR | 8051 | A13 | C3 | C1 | A7 | A8 | A6 | C5 | !EA | ALE | !PSEN | A9 | C4 | AD0..7 | A8..15 | A5 | A11 | C6 | A4 | A3 | A10 | RESET | A2 | C7 | A1 | 74x00 | D7 | EEA1 | EEA2 | EEA3 | A0 | D6 | 8051-like | WP | D0 | D1 | D5 | D4 | D2 | D3 | IC4 | FTDI | Q1 | !RD | 1 | 10.58M | P1-0..7 | P3-0..7
_bsilk: Copyright 2017 by Bill Westfield | C101 | A15 | A14 | Rled | Rled | Rled | A12 | !WR | A7 | !WR | A13 | A6 | A8 | A5 | A9 | A4 | A11 | D0 | D1 | D2 | D3 | D4 | D5 | D6 | D7 | A15 | A14 | A13 | A12 | A11 | A10 | A9 | A8 | A3 | A2 | VCC | C102 | A10 | EEA1 | EEA2 | EEA3 | A1 | A0 | R103 | D7 | D0 | GND | EEPROM | D6 | D1 | D5 | D2 | D4 | D3 | C103 | !RD | C104